# Altium project B.PrjPcb
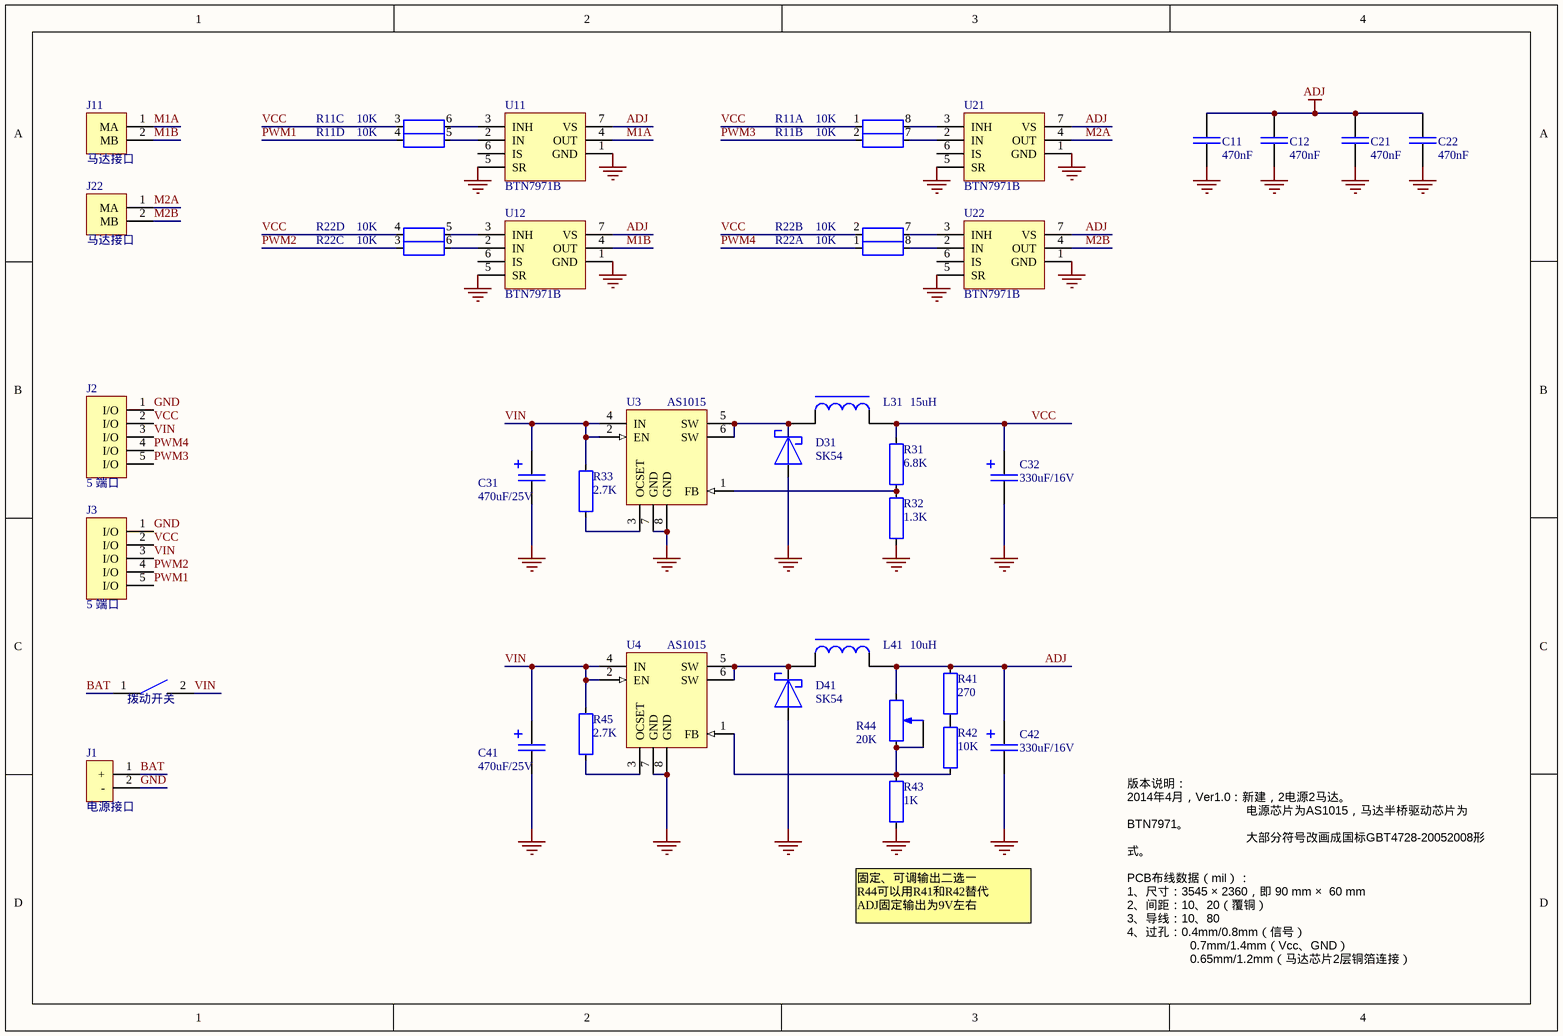
[diagram p0: B.SchDoc]
1 sheet, 34 parts. Net scope: global (net labels, ports and power ports of the same name join across sheets).
Board files: B.PcbDoc, YQYtest.PcbDoc, YQY.PcbDoc

## Sheet B.SchDoc
size A4

### Parts
C11  470nF  [0805]
C12  470nF  [0805]
C21  470nF  [0805]
C22  470nF  [0805]
C31  470uF/25V
C32  330uF/16V
C41  470uF/25V
C42  330uF/16V
D31  SK54  [SMC/DO-214AB]
D41  SK54  [SMC/DO-214AB]
J1  电源接口  [DC12V]
J2  5 端口  [SIP5]
J3  5 端口  [SIP5]
J11  马达接口  [MOTOR-W]
J22  马达接口  [MOTOR-W]
L31  15uH  [4040电感]
L41  10uH  [4040电感]
R11  10K  [PZ-4]  (parts A,B,C,D of 4)
R22  10K  [PZ-4]  (parts A,B,C,D of 4)
R31  6.8K  [0805]
R32  1.3K  [0805]
R33  2.7K  [0805]
R41  270  [0805]
R42  10K  [0805]
R43  1K  [0805]
R44  20K  [电位器]
R45  2.7K  [0805]
U3  AS1015  [SOP8_M]
U4  AS1015  [SOP8_M]
U11  BTN7971B  [TO263-7-1]
U12  BTN7971B  [TO263-7-1]
U21  BTN7971B  [TO263-7-1]
U22  BTN7971B  [TO263-7-1]
拨动开关  开关  [5A120V开关]  (value not drawn)

### Nets
ADJ: C11.2 C12.2 C21.1 C22.1 C42.1 L41.2 R41.2 R44.1 U11.7(VS) U12.7(VS) U21.7(VS) U22.7(VS)
GND: C11.1 C12.1 C21.2 C22.2 C31.2 C32.2 C41.2 C42.2 D31.1(A) D41.1(A) J1.2(-) J2.1(I/O) J3.1(I/O) R32.1 R43.1 U3.7(GND) U3.8(GND) U4.7(GND) U4.8(GND) U11.1(GND) U11.5(SR) U12.1(GND) U12.5(SR) U21.1(GND) U21.5(SR) U22.1(GND) U22.5(SR)
BAT: J1.1(+) 拨动开关.1
M1A: J11.1(MA) U11.4(OUT)
M1B: J11.2(MB) U12.4(OUT)
M2A: J22.1(MA) U21.4(OUT)
M2B: J22.2(MB) U22.4(OUT)
PWM1: J3.5(I/O) R11.4
PWM2: J3.4(I/O) R22.3
PWM3: J2.5(I/O) R11.2
PWM4: J2.4(I/O) R22.1
VCC: C32.1 J2.2(I/O) J3.2(I/O) L31.2 R11.1 R11.3 R22.2 R22.4 R31.2
VIN: C31.1 C41.1 J2.3(I/O) J3.3(I/O) R33.2 R45.2 U3.2(EN) U3.4(IN) U4.2(EN) U4.4(IN) 拨动开关.2
NetD31_2: D31.2(K) L31.1 U3.5(SW) U3.6(SW)
NetD41_2: D41.2(K) L41.1 U4.5(SW) U4.6(SW)
NetR11_5: R11.5 U11.2(IN)
NetR11_6: R11.6 U11.3(INH)
NetR11_7: R11.7 U21.2(IN)
NetR11_8: R11.8 U21.3(INH)
NetR22_5: R22.5 U12.3(INH)
NetR22_6: R22.6 U12.2(IN)
NetR22_7: R22.7 U22.3(INH)
NetR22_8: R22.8 U22.2(IN)
NetR31_1: R31.1 R32.2 U3.1(FB)
NetR33_1: R33.1 U3.3(OCSET)
NetR41_1: R41.1 R42.2
NetR42_1: R42.1 R43.2 R44.2 R44.3 U4.1(FB)
NetR45_1: R45.1 U4.3(OCSET)

Not connected (* = marked no-connect by the designer): U11 6(IS); U12 6(IS); U21 6(IS); U22 6(IS)

### Notes on the sheet
- (near R43) 固定、可调输出二选一
  R44可以用R41和R42替代
  ADJ固定输出为9V左右
- 版本说明：
  2014年4月，Ver1.0：新建，2电源2马达。
  电源芯片为AS1015，马达半桥驱动芯片为BTN7971。
  大部分符号改画成国标GBT4728-20052008形式。
  PCB布线数据（mil）：
  1、尺寸：3545 × 2360，即 90 mm ×  60 mm
  2、间距：10、20（覆铜）
  3、导线：10、80
  4、过孔：0.4mm/0.8mm（信号）
  0.7mm/1.4mm（Vcc、GND）
  0.65mm/1.2mm（马达芯片2层铜箔连接）
  5、丝网字体：5/30（小）、10/60（大）

### Library data of the parts
C11 C12 C21 C22 = C
C31 C32 C41 C42 = C+
D31 D41 = D
L31 L41 = L
R11 R22 = Res Pack: Isolated Resistor Network - Parts
R31-R33 R41-R43 R45 = R
R44 = 可变电阻: Potentiometer
拨动开关 = 开关: Published: 24-Mar-1999; LatestRevisionDate: 17-Dec-2003; LatestRevisionNote: Schematic revised, PCB Footprint replaced.; DatasheetDocument: 05-Dec-2000; Publisher: Altium Limited